# EAGLE schematic trig3_board_de0-nano (EAGLE 9.2.0)
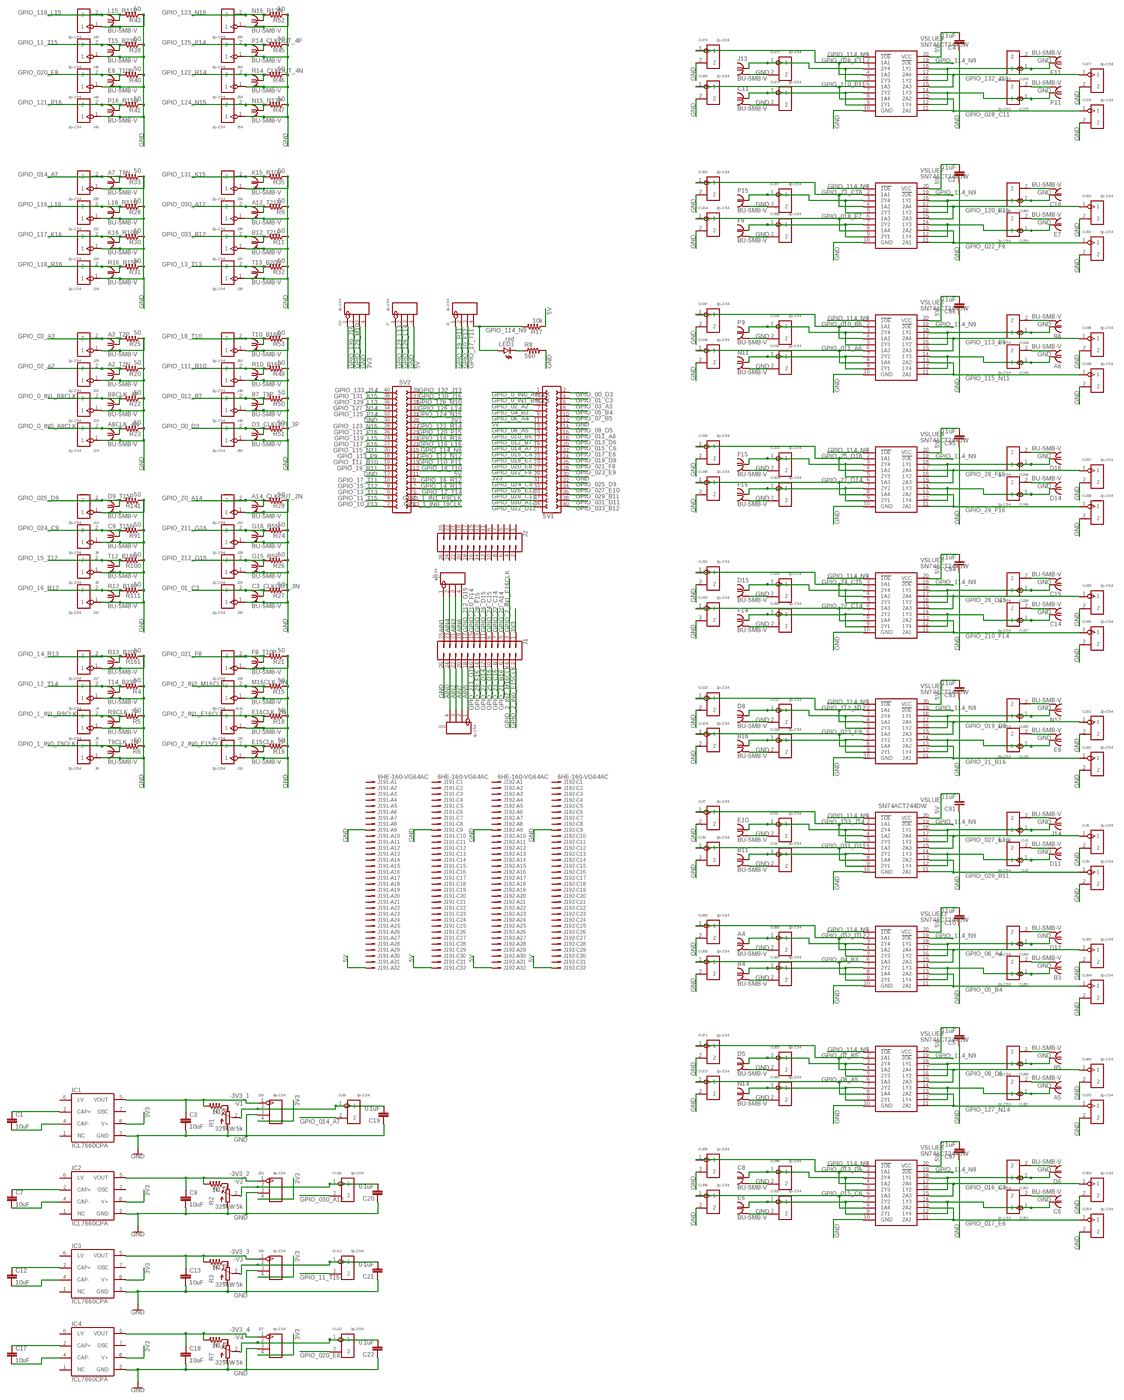
[diagram p0: schematic, sheet 1, overview]
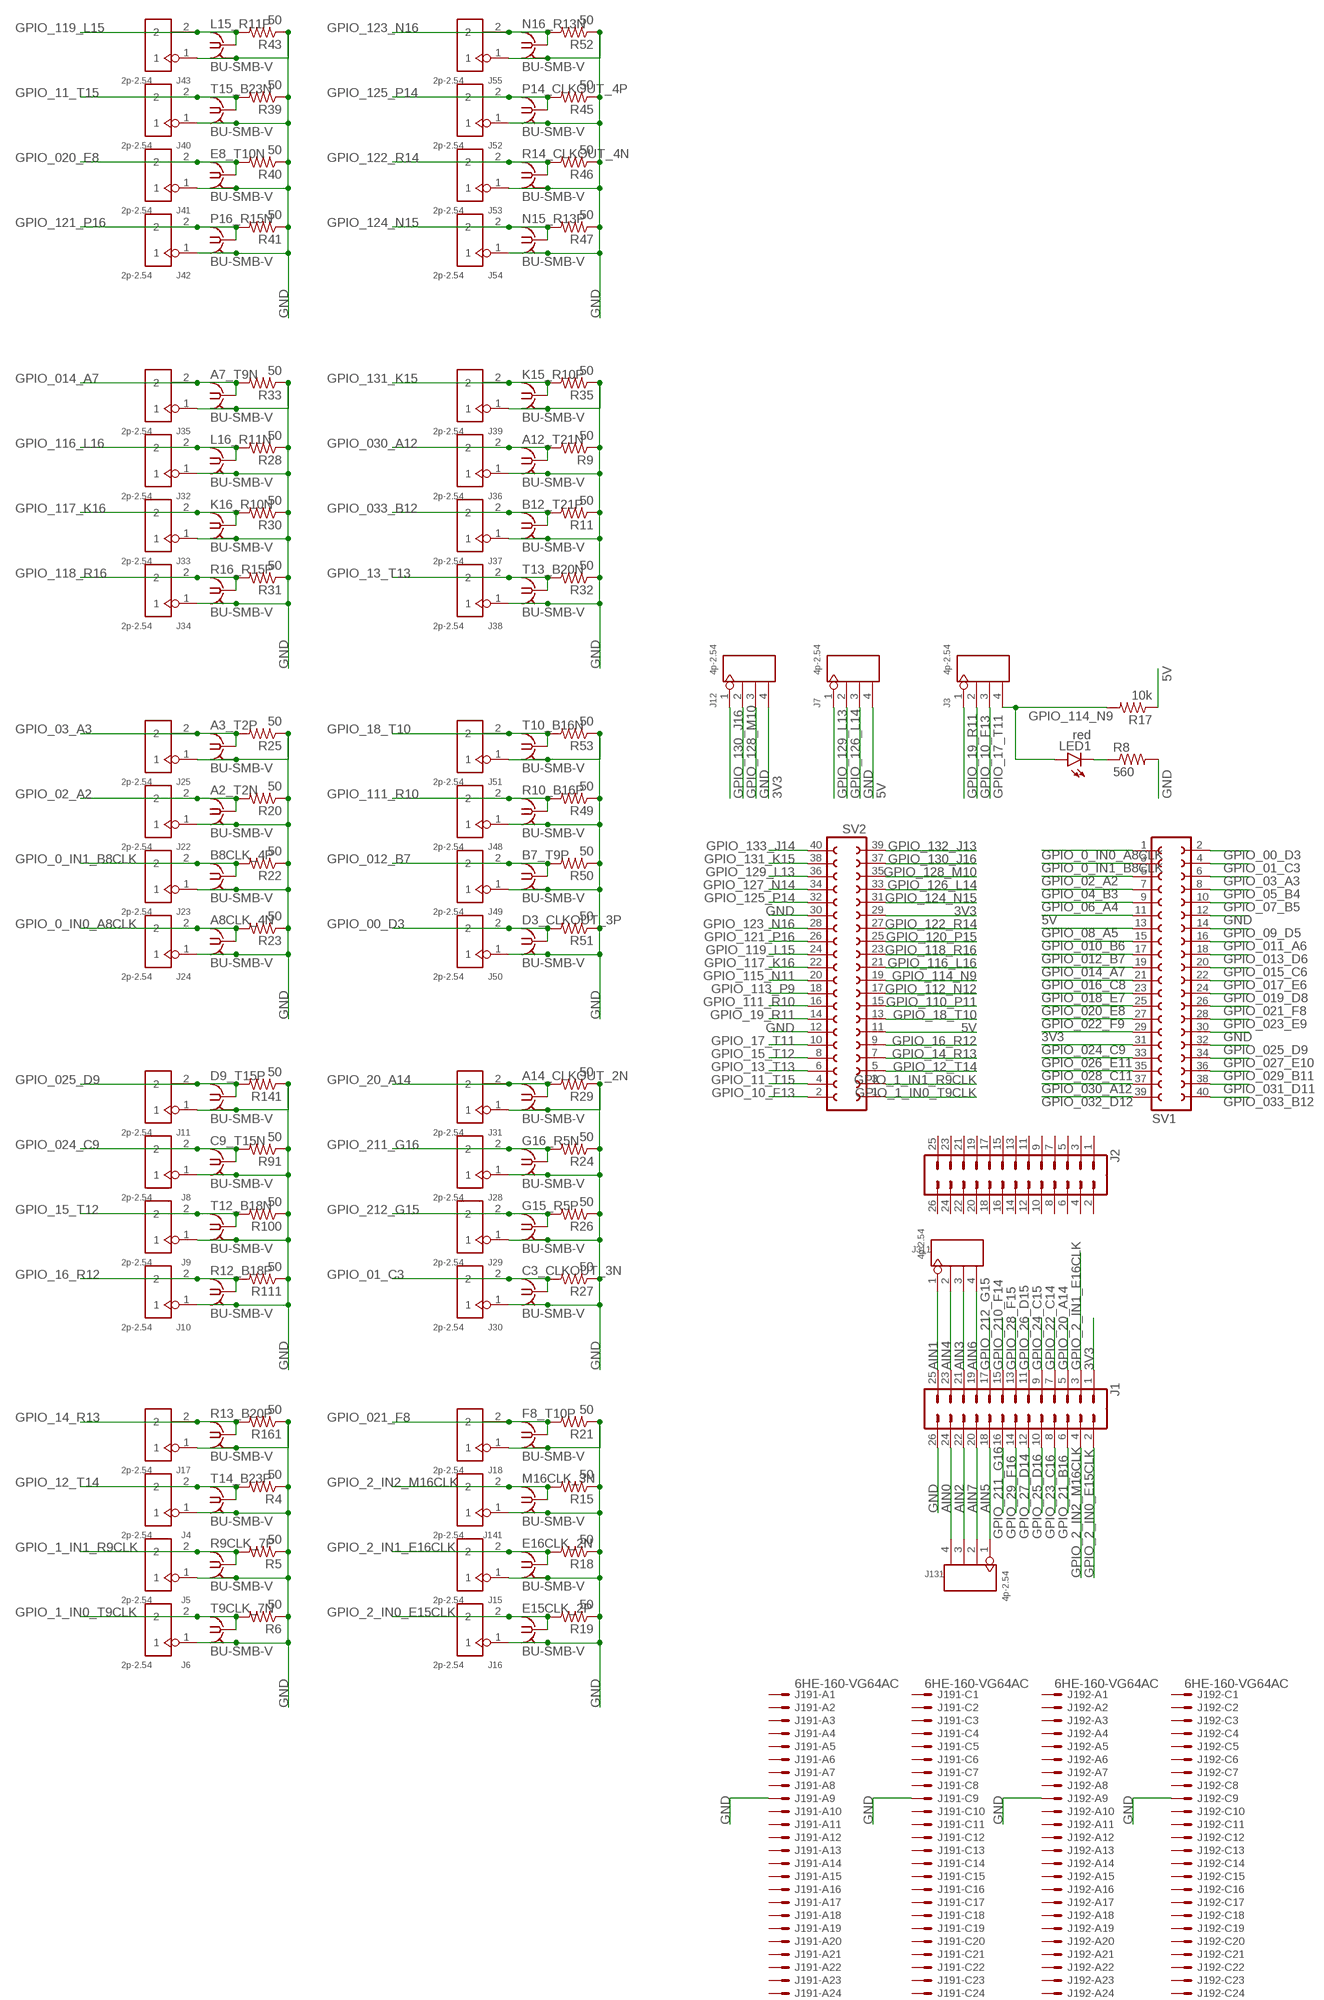
[diagram p1: schematic, sheet 1, part 1 of 4]
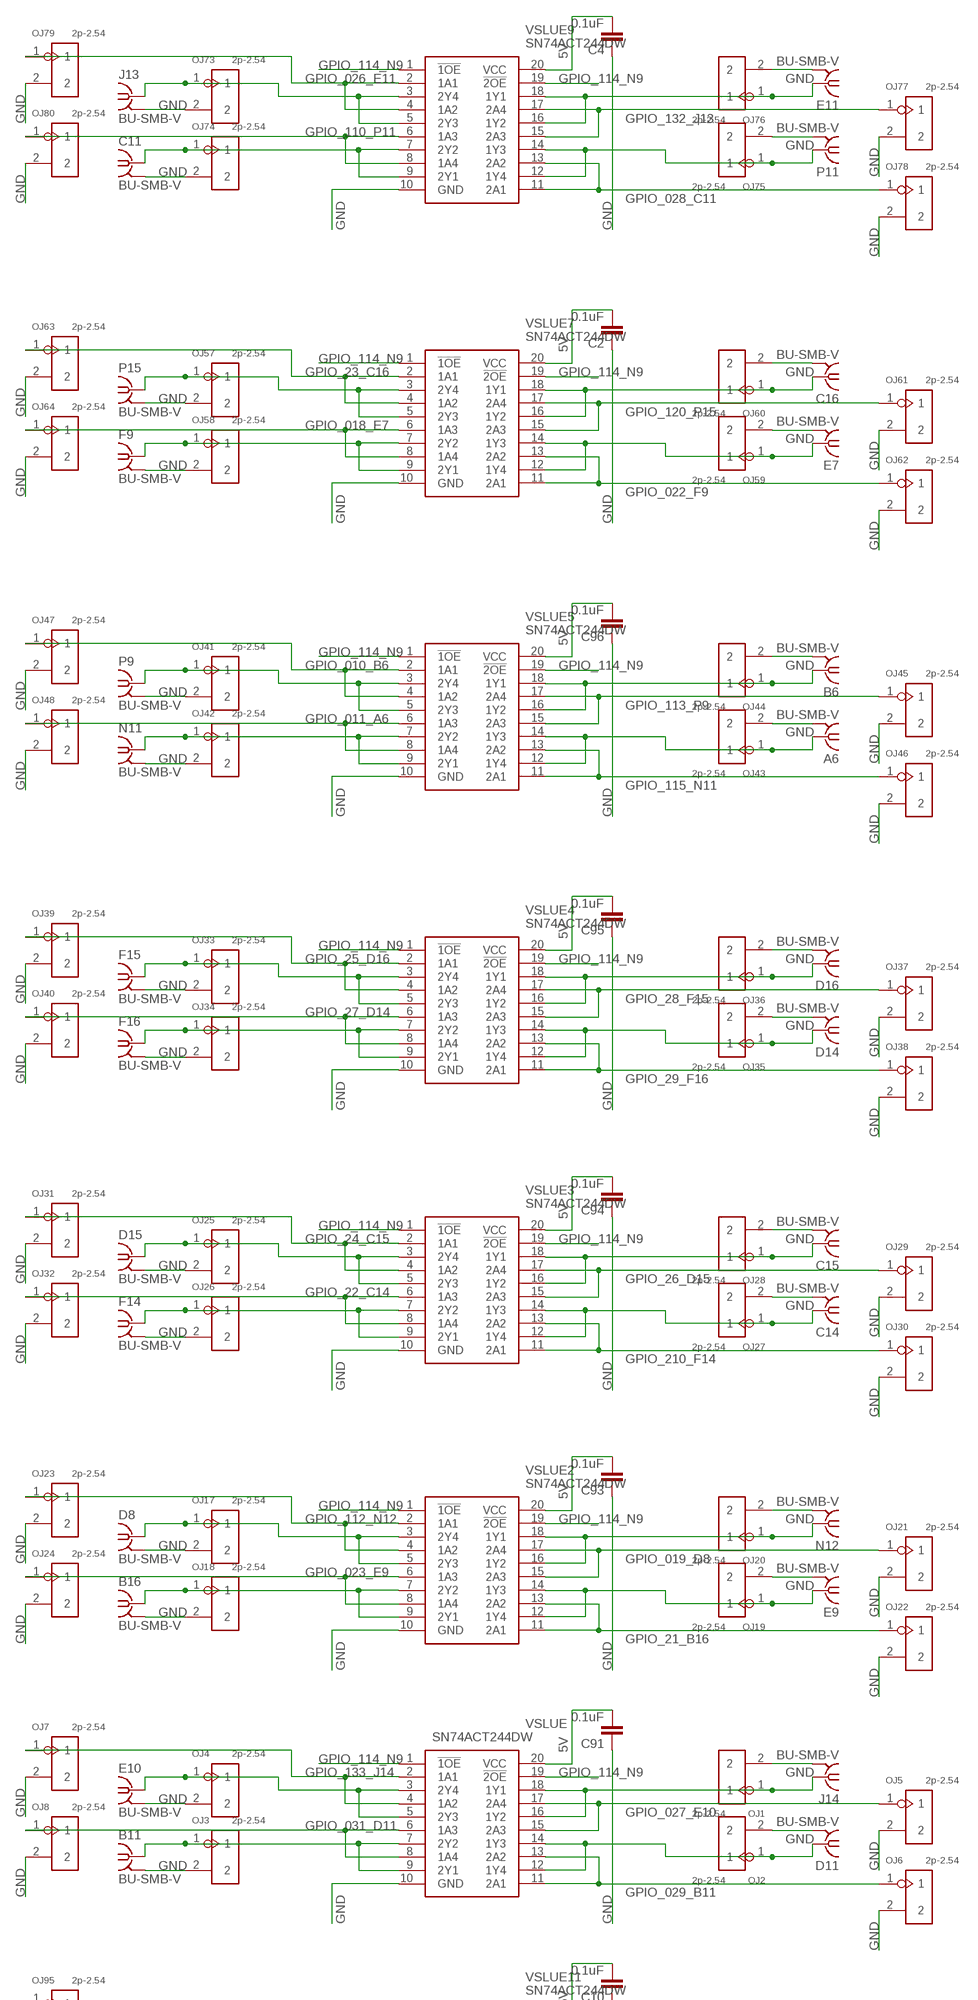
[diagram p2: schematic, sheet 1, part 2 of 4]
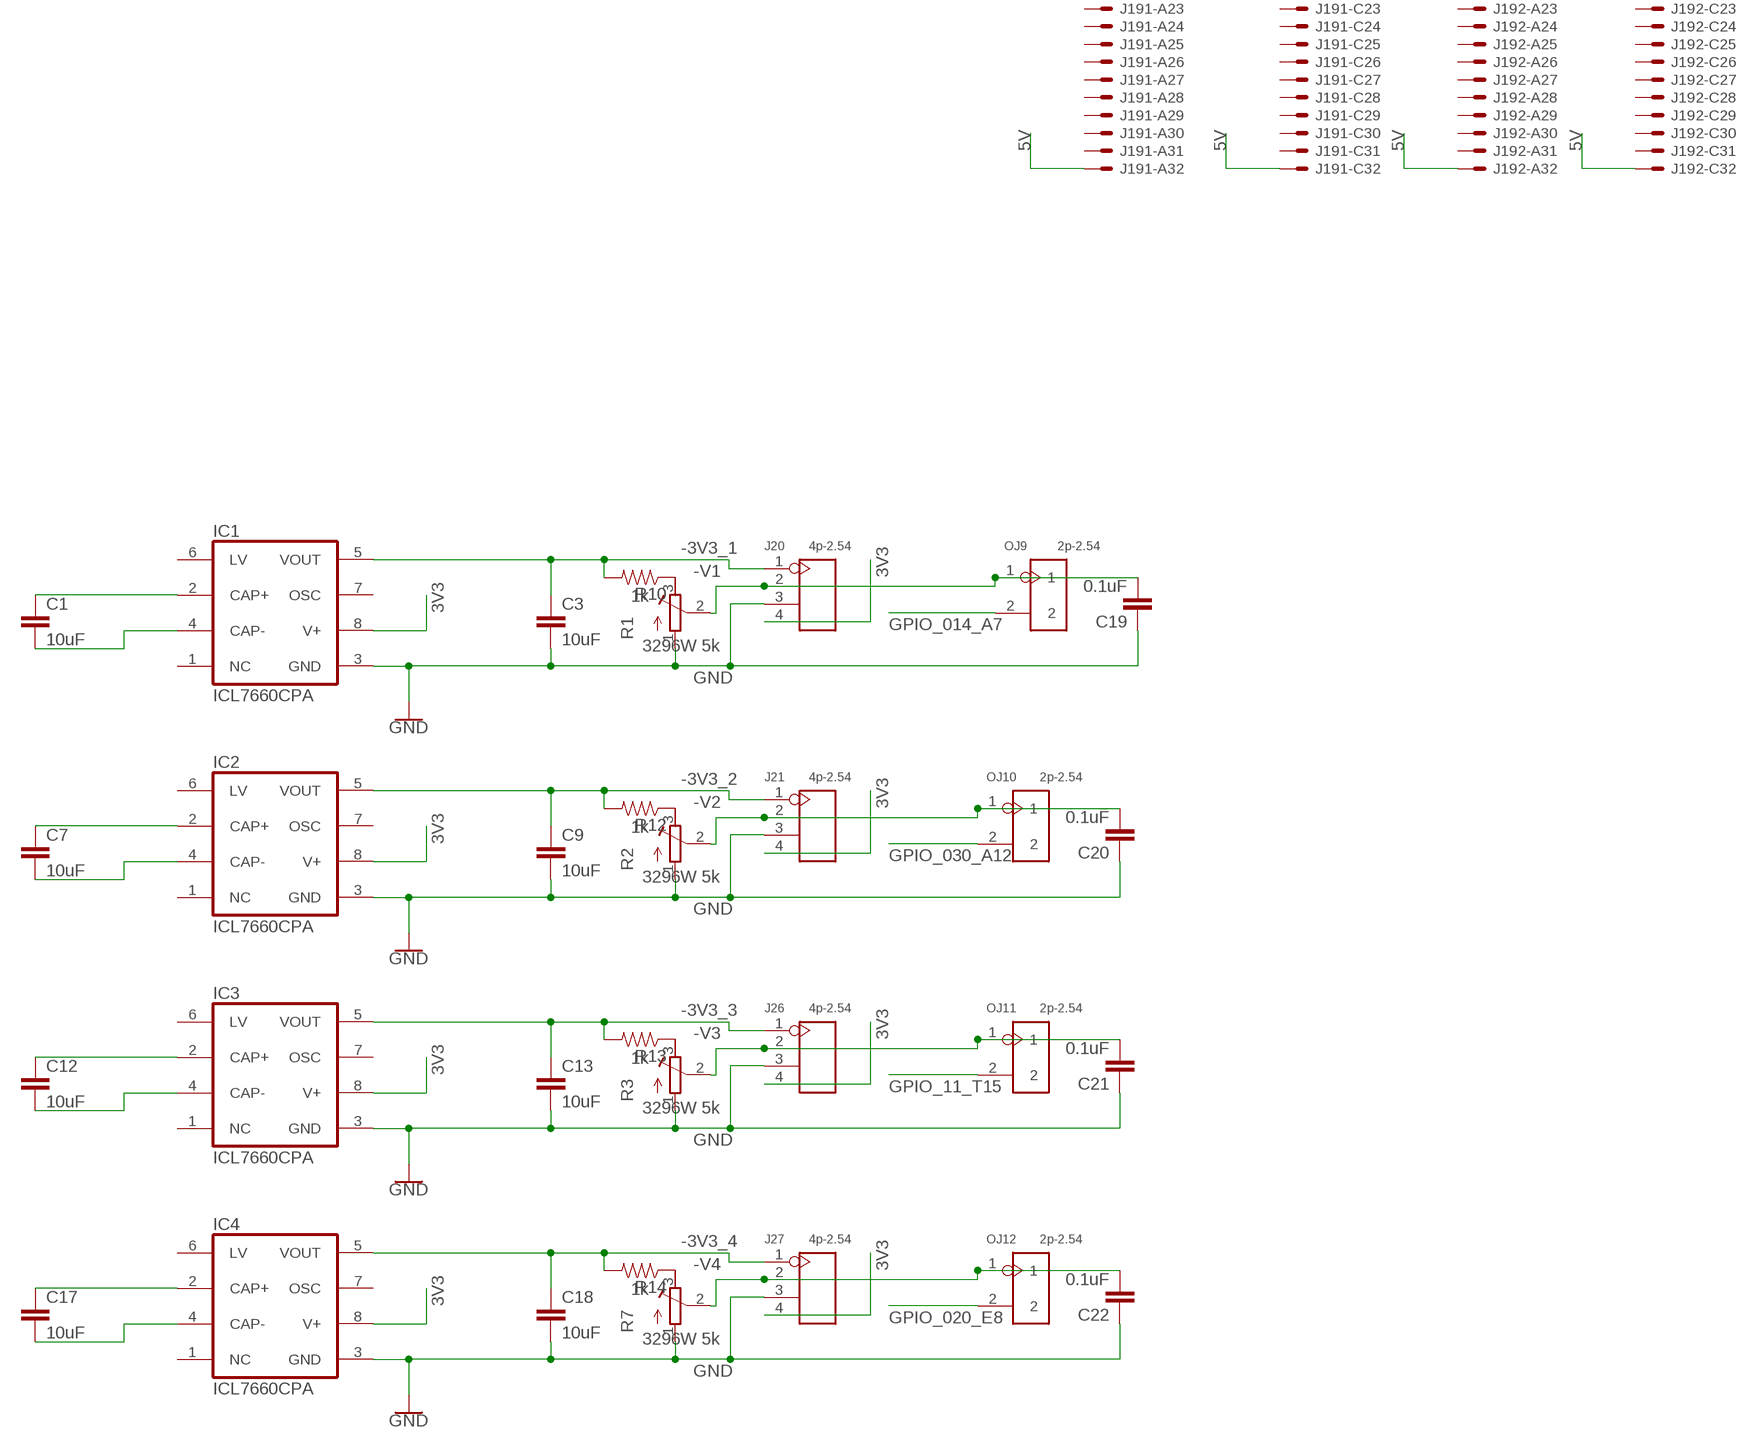
[diagram p3: schematic, sheet 1, part 3 of 4]
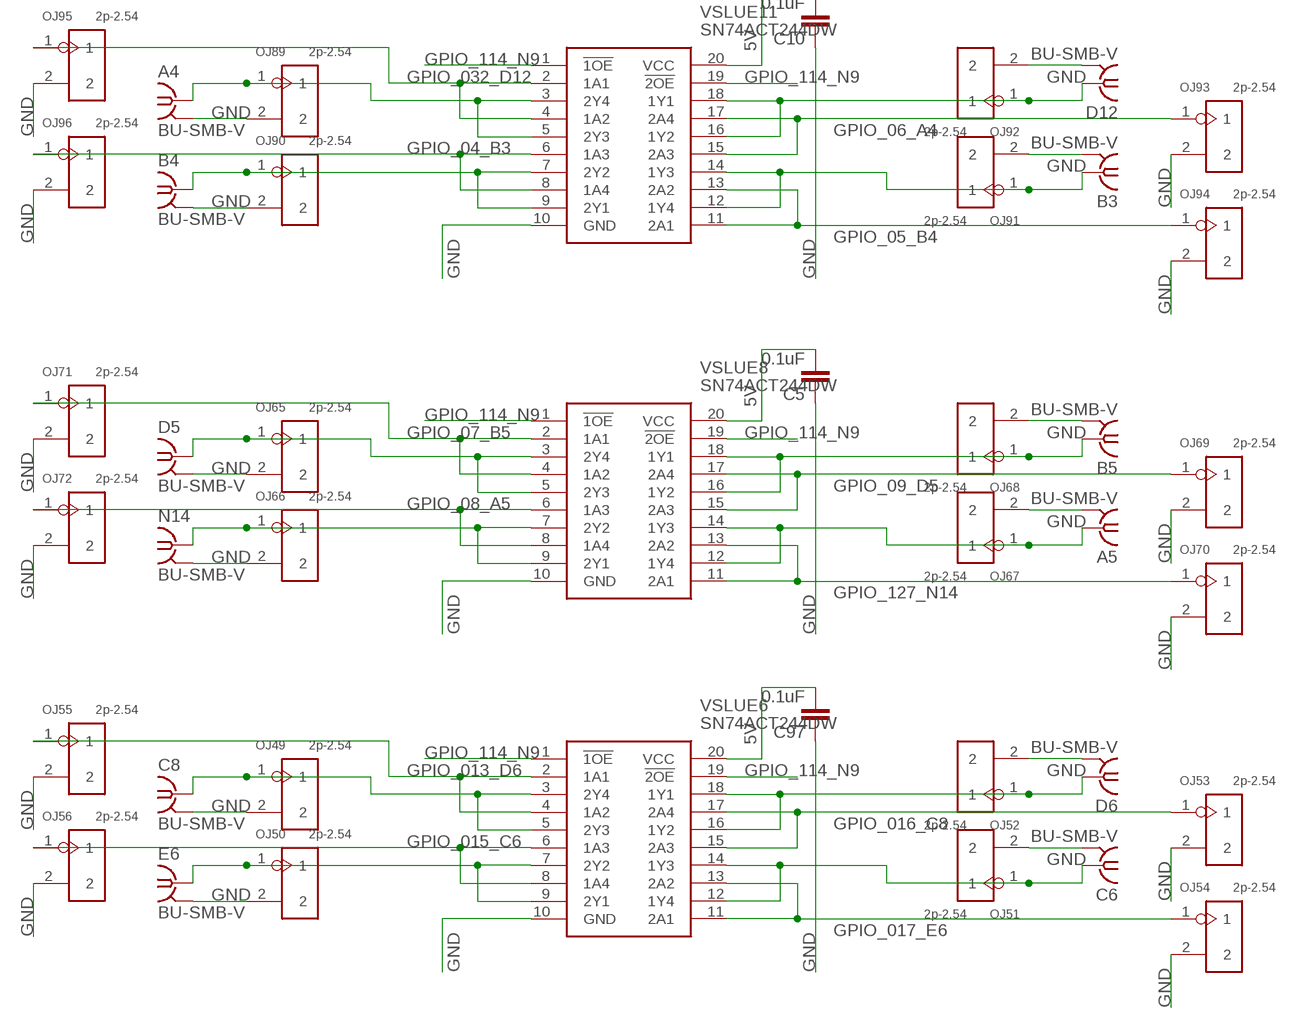
[diagram p4: schematic, sheet 1, part 4 of 4]

## Parts
A2_T2N  BU-SMB-V  [BU-SMB-V]
A3_T2P  BU-SMB-V  [BU-SMB-V]
A4  BU-SMB-V  [BU-SMB-V]
A5  BU-SMB-V  [BU-SMB-V]
A6  BU-SMB-V  [BU-SMB-V]
A7_T9N  BU-SMB-V  [BU-SMB-V]
A8CLK_4N  BU-SMB-V  [BU-SMB-V]
A12_T21N  BU-SMB-V  [BU-SMB-V]
A14_CLKOUT_2N  BU-SMB-V  [BU-SMB-V]
B3  BU-SMB-V  [BU-SMB-V]
B4  BU-SMB-V  [BU-SMB-V]
B5  BU-SMB-V  [BU-SMB-V]
B6  BU-SMB-V  [BU-SMB-V]
B7_T9P  BU-SMB-V  [BU-SMB-V]
B8CLK_4P  BU-SMB-V  [BU-SMB-V]
B11  BU-SMB-V  [BU-SMB-V]
B12_T21P  BU-SMB-V  [BU-SMB-V]
B16  BU-SMB-V  [BU-SMB-V]
C1  10uF  CAPPTH1  [CAP-PTH-5MM]
C2  0.1uF  CAP0805  [0805]
C3  10uF  CAPPTH1  [CAP-PTH-5MM]
C3_CLKOUT_3N  BU-SMB-V  [BU-SMB-V]
C4  0.1uF  CAP0805  [0805]
C5  0.1uF  CAP0805  [0805]
C6  BU-SMB-V  [BU-SMB-V]
C7  10uF  CAPPTH1  [CAP-PTH-5MM]
C8  BU-SMB-V  [BU-SMB-V]
C9  10uF  CAPPTH1  [CAP-PTH-5MM]
C9_T15N  BU-SMB-V  [BU-SMB-V]
C10  0.1uF  CAP0805  [0805]
C11  BU-SMB-V  [BU-SMB-V]
C12  10uF  CAPPTH1  [CAP-PTH-5MM]
C13  10uF  CAPPTH1  [CAP-PTH-5MM]
C14  BU-SMB-V  [BU-SMB-V]
C15  BU-SMB-V  [BU-SMB-V]
C16  BU-SMB-V  [BU-SMB-V]
C17  10uF  CAPPTH1  [CAP-PTH-5MM]
C18  10uF  CAPPTH1  [CAP-PTH-5MM]
C19  0.1uF  CAP0805  [0805]
C20  0.1uF  CAP0805  [0805]
C21  0.1uF  CAP0805  [0805]
C22  0.1uF  CAP0805  [0805]
C91  0.1uF  CAP0805  [0805]
C93  0.1uF  CAP0805  [0805]
C94  0.1uF  CAP0805  [0805]
C95  0.1uF  CAP0805  [0805]
C96  0.1uF  CAP0805  [0805]
C97  0.1uF  CAP0805  [0805]
D3_CLKOUT_3P  BU-SMB-V  [BU-SMB-V]
D5  BU-SMB-V  [BU-SMB-V]
D6  BU-SMB-V  [BU-SMB-V]
D8  BU-SMB-V  [BU-SMB-V]
D9_T15P  BU-SMB-V  [BU-SMB-V]
D11  BU-SMB-V  [BU-SMB-V]
D12  BU-SMB-V  [BU-SMB-V]
D14  BU-SMB-V  [BU-SMB-V]
D15  BU-SMB-V  [BU-SMB-V]
D16  BU-SMB-V  [BU-SMB-V]
E6  BU-SMB-V  [BU-SMB-V]
E7  BU-SMB-V  [BU-SMB-V]
E8_T10N  BU-SMB-V  [BU-SMB-V]
E9  BU-SMB-V  [BU-SMB-V]
E10  BU-SMB-V  [BU-SMB-V]
E11  BU-SMB-V  [BU-SMB-V]
E15CLK_2P  BU-SMB-V  [BU-SMB-V]
E16CLK_2N  BU-SMB-V  [BU-SMB-V]
F8_T10P  BU-SMB-V  [BU-SMB-V]
F9  BU-SMB-V  [BU-SMB-V]
F14  BU-SMB-V  [BU-SMB-V]
F15  BU-SMB-V  [BU-SMB-V]
F16  BU-SMB-V  [BU-SMB-V]
G15_R5P  BU-SMB-V  [BU-SMB-V]
G16_R5N  BU-SMB-V  [BU-SMB-V]
IC1  ICL7660CPA  [DIL08]
IC2  ICL7660CPA  [DIL08]
IC3  ICL7660CPA  [DIL08]
IC4  ICL7660CPA  [DIL08]
J1  M13X22X13  [2X13]
J2  M13X22X13  [2X13]
J3  4p-2.54  DIP-BLACK-FEMALE-HEADER-VERT(4P-2.54)  [H4-2.54]
J4  2p-2.54  DIP-BLACK-MALE-HEADER-VERT(2P-2.54)  [H2-2.54]
J5  2p-2.54  DIP-BLACK-MALE-HEADER-VERT(2P-2.54)  [H2-2.54]
J6  2p-2.54  DIP-BLACK-MALE-HEADER-VERT(2P-2.54)  [H2-2.54]
J7  4p-2.54  DIP-BLACK-FEMALE-HEADER-VERT(4P-2.54)  [H4-2.54]
J8  2p-2.54  DIP-BLACK-MALE-HEADER-VERT(2P-2.54)  [H2-2.54]
J9  2p-2.54  DIP-BLACK-MALE-HEADER-VERT(2P-2.54)  [H2-2.54]
J10  2p-2.54  DIP-BLACK-MALE-HEADER-VERT(2P-2.54)  [H2-2.54]
J11  2p-2.54  DIP-BLACK-MALE-HEADER-VERT(2P-2.54)  [H2-2.54]
J12  4p-2.54  DIP-BLACK-FEMALE-HEADER-VERT(4P-2.54)  [H4-2.54]
J13  BU-SMB-V  [BU-SMB-V]
J14  BU-SMB-V  [BU-SMB-V]
J15  2p-2.54  DIP-BLACK-MALE-HEADER-VERT(2P-2.54)  [H2-2.54]
J16  2p-2.54  DIP-BLACK-MALE-HEADER-VERT(2P-2.54)  [H2-2.54]
J17  2p-2.54  DIP-BLACK-MALE-HEADER-VERT(2P-2.54)  [H2-2.54]
J18  2p-2.54  DIP-BLACK-MALE-HEADER-VERT(2P-2.54)  [H2-2.54]
J19  6HE-160-VG64AC  [6HE_160-VG64AC]
J20  4p-2.54  DIP-BLACK-MALE-HEADER-VERT(4P-2.54)  [H4-2.54]
J21  4p-2.54  DIP-BLACK-MALE-HEADER-VERT(4P-2.54)  [H4-2.54]
J22  2p-2.54  DIP-BLACK-MALE-HEADER-VERT(2P-2.54)  [H2-2.54]
J23  2p-2.54  DIP-BLACK-MALE-HEADER-VERT(2P-2.54)  [H2-2.54]
J24  2p-2.54  DIP-BLACK-MALE-HEADER-VERT(2P-2.54)  [H2-2.54]
J25  2p-2.54  DIP-BLACK-MALE-HEADER-VERT(2P-2.54)  [H2-2.54]
J26  4p-2.54  DIP-BLACK-MALE-HEADER-VERT(4P-2.54)  [H4-2.54]
J27  4p-2.54  DIP-BLACK-MALE-HEADER-VERT(4P-2.54)  [H4-2.54]
J28  2p-2.54  DIP-BLACK-MALE-HEADER-VERT(2P-2.54)  [H2-2.54]
J29  2p-2.54  DIP-BLACK-MALE-HEADER-VERT(2P-2.54)  [H2-2.54]
J30  2p-2.54  DIP-BLACK-MALE-HEADER-VERT(2P-2.54)  [H2-2.54]
J31  2p-2.54  DIP-BLACK-MALE-HEADER-VERT(2P-2.54)  [H2-2.54]
J32  2p-2.54  DIP-BLACK-MALE-HEADER-VERT(2P-2.54)  [H2-2.54]
J33  2p-2.54  DIP-BLACK-MALE-HEADER-VERT(2P-2.54)  [H2-2.54]
J34  2p-2.54  DIP-BLACK-MALE-HEADER-VERT(2P-2.54)  [H2-2.54]
J35  2p-2.54  DIP-BLACK-MALE-HEADER-VERT(2P-2.54)  [H2-2.54]
J36  2p-2.54  DIP-BLACK-MALE-HEADER-VERT(2P-2.54)  [H2-2.54]
J37  2p-2.54  DIP-BLACK-MALE-HEADER-VERT(2P-2.54)  [H2-2.54]
J38  2p-2.54  DIP-BLACK-MALE-HEADER-VERT(2P-2.54)  [H2-2.54]
J39  2p-2.54  DIP-BLACK-MALE-HEADER-VERT(2P-2.54)  [H2-2.54]
J40  2p-2.54  DIP-BLACK-MALE-HEADER-VERT(2P-2.54)  [H2-2.54]
J41  2p-2.54  DIP-BLACK-MALE-HEADER-VERT(2P-2.54)  [H2-2.54]
J42  2p-2.54  DIP-BLACK-MALE-HEADER-VERT(2P-2.54)  [H2-2.54]
J43  2p-2.54  DIP-BLACK-MALE-HEADER-VERT(2P-2.54)  [H2-2.54]
J48  2p-2.54  DIP-BLACK-MALE-HEADER-VERT(2P-2.54)  [H2-2.54]
J49  2p-2.54  DIP-BLACK-MALE-HEADER-VERT(2P-2.54)  [H2-2.54]
J50  2p-2.54  DIP-BLACK-MALE-HEADER-VERT(2P-2.54)  [H2-2.54]
J51  2p-2.54  DIP-BLACK-MALE-HEADER-VERT(2P-2.54)  [H2-2.54]
J52  2p-2.54  DIP-BLACK-MALE-HEADER-VERT(2P-2.54)  [H2-2.54]
J53  2p-2.54  DIP-BLACK-MALE-HEADER-VERT(2P-2.54)  [H2-2.54]
J54  2p-2.54  DIP-BLACK-MALE-HEADER-VERT(2P-2.54)  [H2-2.54]
J55  2p-2.54  DIP-BLACK-MALE-HEADER-VERT(2P-2.54)  [H2-2.54]
J131  4p-2.54  DIP-BLACK-FEMALE-HEADER-VERT(4P-2.54)  [H4-2.54]
J141  2p-2.54  DIP-BLACK-MALE-HEADER-VERT(2P-2.54)  [H2-2.54]
J311  4p-2.54  DIP-BLACK-FEMALE-HEADER-VERT(4P-2.54)  [H4-2.54]
K15_R10P  BU-SMB-V  [BU-SMB-V]
K16_R10N  BU-SMB-V  [BU-SMB-V]
L15_R11P  BU-SMB-V  [BU-SMB-V]
L16_R11N  BU-SMB-V  [BU-SMB-V]
LED1  red  LEDCHIP-LED0805  [CHIP-LED0805]
M16CLK_3N  BU-SMB-V  [BU-SMB-V]
N11  BU-SMB-V  [BU-SMB-V]
N12  BU-SMB-V  [BU-SMB-V]
N14  BU-SMB-V  [BU-SMB-V]
N15_R13P  BU-SMB-V  [BU-SMB-V]
N16_R13N  BU-SMB-V  [BU-SMB-V]
OJ1  2p-2.54  DIP-BLACK-MALE-HEADER-VERT(2P-2.54)  [H2-2.54]
OJ2  2p-2.54  DIP-BLACK-MALE-HEADER-VERT(2P-2.54)  [H2-2.54]
OJ3  2p-2.54  DIP-BLACK-MALE-HEADER-VERT(2P-2.54)  [H2-2.54]
OJ4  2p-2.54  DIP-BLACK-MALE-HEADER-VERT(2P-2.54)  [H2-2.54]
OJ5  2p-2.54  DIP-BLACK-MALE-HEADER-VERT(2P-2.54)  [H2-2.54]
OJ6  2p-2.54  DIP-BLACK-MALE-HEADER-VERT(2P-2.54)  [H2-2.54]
OJ7  2p-2.54  DIP-BLACK-MALE-HEADER-VERT(2P-2.54)  [H2-2.54]
OJ8  2p-2.54  DIP-BLACK-MALE-HEADER-VERT(2P-2.54)  [H2-2.54]
OJ9  2p-2.54  DIP-BLACK-MALE-HEADER-VERT(2P-2.54)  [H2-2.54]
OJ10  2p-2.54  DIP-BLACK-MALE-HEADER-VERT(2P-2.54)  [H2-2.54]
OJ11  2p-2.54  DIP-BLACK-MALE-HEADER-VERT(2P-2.54)  [H2-2.54]
OJ12  2p-2.54  DIP-BLACK-MALE-HEADER-VERT(2P-2.54)  [H2-2.54]
OJ17  2p-2.54  DIP-BLACK-MALE-HEADER-VERT(2P-2.54)  [H2-2.54]
OJ18  2p-2.54  DIP-BLACK-MALE-HEADER-VERT(2P-2.54)  [H2-2.54]
OJ19  2p-2.54  DIP-BLACK-MALE-HEADER-VERT(2P-2.54)  [H2-2.54]
OJ20  2p-2.54  DIP-BLACK-MALE-HEADER-VERT(2P-2.54)  [H2-2.54]
OJ21  2p-2.54  DIP-BLACK-MALE-HEADER-VERT(2P-2.54)  [H2-2.54]
OJ22  2p-2.54  DIP-BLACK-MALE-HEADER-VERT(2P-2.54)  [H2-2.54]
OJ23  2p-2.54  DIP-BLACK-MALE-HEADER-VERT(2P-2.54)  [H2-2.54]
OJ24  2p-2.54  DIP-BLACK-MALE-HEADER-VERT(2P-2.54)  [H2-2.54]
OJ25  2p-2.54  DIP-BLACK-MALE-HEADER-VERT(2P-2.54)  [H2-2.54]
OJ26  2p-2.54  DIP-BLACK-MALE-HEADER-VERT(2P-2.54)  [H2-2.54]
OJ27  2p-2.54  DIP-BLACK-MALE-HEADER-VERT(2P-2.54)  [H2-2.54]
OJ28  2p-2.54  DIP-BLACK-MALE-HEADER-VERT(2P-2.54)  [H2-2.54]
OJ29  2p-2.54  DIP-BLACK-MALE-HEADER-VERT(2P-2.54)  [H2-2.54]
OJ30  2p-2.54  DIP-BLACK-MALE-HEADER-VERT(2P-2.54)  [H2-2.54]
OJ31  2p-2.54  DIP-BLACK-MALE-HEADER-VERT(2P-2.54)  [H2-2.54]
OJ32  2p-2.54  DIP-BLACK-MALE-HEADER-VERT(2P-2.54)  [H2-2.54]
OJ33  2p-2.54  DIP-BLACK-MALE-HEADER-VERT(2P-2.54)  [H2-2.54]
OJ34  2p-2.54  DIP-BLACK-MALE-HEADER-VERT(2P-2.54)  [H2-2.54]
OJ35  2p-2.54  DIP-BLACK-MALE-HEADER-VERT(2P-2.54)  [H2-2.54]
OJ36  2p-2.54  DIP-BLACK-MALE-HEADER-VERT(2P-2.54)  [H2-2.54]
OJ37  2p-2.54  DIP-BLACK-MALE-HEADER-VERT(2P-2.54)  [H2-2.54]
OJ38  2p-2.54  DIP-BLACK-MALE-HEADER-VERT(2P-2.54)  [H2-2.54]
OJ39  2p-2.54  DIP-BLACK-MALE-HEADER-VERT(2P-2.54)  [H2-2.54]
OJ40  2p-2.54  DIP-BLACK-MALE-HEADER-VERT(2P-2.54)  [H2-2.54]
OJ41  2p-2.54  DIP-BLACK-MALE-HEADER-VERT(2P-2.54)  [H2-2.54]
OJ42  2p-2.54  DIP-BLACK-MALE-HEADER-VERT(2P-2.54)  [H2-2.54]
OJ43  2p-2.54  DIP-BLACK-MALE-HEADER-VERT(2P-2.54)  [H2-2.54]
OJ44  2p-2.54  DIP-BLACK-MALE-HEADER-VERT(2P-2.54)  [H2-2.54]
OJ45  2p-2.54  DIP-BLACK-MALE-HEADER-VERT(2P-2.54)  [H2-2.54]
OJ46  2p-2.54  DIP-BLACK-MALE-HEADER-VERT(2P-2.54)  [H2-2.54]
OJ47  2p-2.54  DIP-BLACK-MALE-HEADER-VERT(2P-2.54)  [H2-2.54]
OJ48  2p-2.54  DIP-BLACK-MALE-HEADER-VERT(2P-2.54)  [H2-2.54]
OJ49  2p-2.54  DIP-BLACK-MALE-HEADER-VERT(2P-2.54)  [H2-2.54]
OJ50  2p-2.54  DIP-BLACK-MALE-HEADER-VERT(2P-2.54)  [H2-2.54]
OJ51  2p-2.54  DIP-BLACK-MALE-HEADER-VERT(2P-2.54)  [H2-2.54]
OJ52  2p-2.54  DIP-BLACK-MALE-HEADER-VERT(2P-2.54)  [H2-2.54]
OJ53  2p-2.54  DIP-BLACK-MALE-HEADER-VERT(2P-2.54)  [H2-2.54]
OJ54  2p-2.54  DIP-BLACK-MALE-HEADER-VERT(2P-2.54)  [H2-2.54]
OJ55  2p-2.54  DIP-BLACK-MALE-HEADER-VERT(2P-2.54)  [H2-2.54]
OJ56  2p-2.54  DIP-BLACK-MALE-HEADER-VERT(2P-2.54)  [H2-2.54]
OJ57  2p-2.54  DIP-BLACK-MALE-HEADER-VERT(2P-2.54)  [H2-2.54]
OJ58  2p-2.54  DIP-BLACK-MALE-HEADER-VERT(2P-2.54)  [H2-2.54]
OJ59  2p-2.54  DIP-BLACK-MALE-HEADER-VERT(2P-2.54)  [H2-2.54]
OJ60  2p-2.54  DIP-BLACK-MALE-HEADER-VERT(2P-2.54)  [H2-2.54]
OJ61  2p-2.54  DIP-BLACK-MALE-HEADER-VERT(2P-2.54)  [H2-2.54]
OJ62  2p-2.54  DIP-BLACK-MALE-HEADER-VERT(2P-2.54)  [H2-2.54]
OJ63  2p-2.54  DIP-BLACK-MALE-HEADER-VERT(2P-2.54)  [H2-2.54]
OJ64  2p-2.54  DIP-BLACK-MALE-HEADER-VERT(2P-2.54)  [H2-2.54]
OJ65  2p-2.54  DIP-BLACK-MALE-HEADER-VERT(2P-2.54)  [H2-2.54]
OJ66  2p-2.54  DIP-BLACK-MALE-HEADER-VERT(2P-2.54)  [H2-2.54]
OJ67  2p-2.54  DIP-BLACK-MALE-HEADER-VERT(2P-2.54)  [H2-2.54]
OJ68  2p-2.54  DIP-BLACK-MALE-HEADER-VERT(2P-2.54)  [H2-2.54]
OJ69  2p-2.54  DIP-BLACK-MALE-HEADER-VERT(2P-2.54)  [H2-2.54]
OJ70  2p-2.54  DIP-BLACK-MALE-HEADER-VERT(2P-2.54)  [H2-2.54]
OJ71  2p-2.54  DIP-BLACK-MALE-HEADER-VERT(2P-2.54)  [H2-2.54]
OJ72  2p-2.54  DIP-BLACK-MALE-HEADER-VERT(2P-2.54)  [H2-2.54]
OJ73  2p-2.54  DIP-BLACK-MALE-HEADER-VERT(2P-2.54)  [H2-2.54]
OJ74  2p-2.54  DIP-BLACK-MALE-HEADER-VERT(2P-2.54)  [H2-2.54]
OJ75  2p-2.54  DIP-BLACK-MALE-HEADER-VERT(2P-2.54)  [H2-2.54]
OJ76  2p-2.54  DIP-BLACK-MALE-HEADER-VERT(2P-2.54)  [H2-2.54]
OJ77  2p-2.54  DIP-BLACK-MALE-HEADER-VERT(2P-2.54)  [H2-2.54]
OJ78  2p-2.54  DIP-BLACK-MALE-HEADER-VERT(2P-2.54)  [H2-2.54]
OJ79  2p-2.54  DIP-BLACK-MALE-HEADER-VERT(2P-2.54)  [H2-2.54]
OJ80  2p-2.54  DIP-BLACK-MALE-HEADER-VERT(2P-2.54)  [H2-2.54]
OJ89  2p-2.54  DIP-BLACK-MALE-HEADER-VERT(2P-2.54)  [H2-2.54]
OJ90  2p-2.54  DIP-BLACK-MALE-HEADER-VERT(2P-2.54)  [H2-2.54]
OJ91  2p-2.54  DIP-BLACK-MALE-HEADER-VERT(2P-2.54)  [H2-2.54]
OJ92  2p-2.54  DIP-BLACK-MALE-HEADER-VERT(2P-2.54)  [H2-2.54]
OJ93  2p-2.54  DIP-BLACK-MALE-HEADER-VERT(2P-2.54)  [H2-2.54]
OJ94  2p-2.54  DIP-BLACK-MALE-HEADER-VERT(2P-2.54)  [H2-2.54]
OJ95  2p-2.54  DIP-BLACK-MALE-HEADER-VERT(2P-2.54)  [H2-2.54]
OJ96  2p-2.54  DIP-BLACK-MALE-HEADER-VERT(2P-2.54)  [H2-2.54]
P9  BU-SMB-V  [BU-SMB-V]
P11  BU-SMB-V  [BU-SMB-V]
P14_CLKOUT_4P  BU-SMB-V  [BU-SMB-V]
P15  BU-SMB-V  [BU-SMB-V]
P16_R15N  BU-SMB-V  [BU-SMB-V]
R1  3296W 5k  R-TRIMM3296W  [RTRIM3296W]
R2  3296W 5k  R-TRIMM3296W  [RTRIM3296W]
R3  3296W 5k  R-TRIMM3296W  [RTRIM3296W]
R4  50  RESISTORAXIAL-0.3  [AXIAL-0.3]
R5  50  RESISTORAXIAL-0.3  [AXIAL-0.3]
R6  50  RESISTORAXIAL-0.3  [AXIAL-0.3]
R7  3296W 5k  R-TRIMM3296W  [RTRIM3296W]
R8  560  R-US_R0805  [R0805]
R9  50  RESISTORAXIAL-0.3  [AXIAL-0.3]
R9CLK_7P  BU-SMB-V  [BU-SMB-V]
R10  1k  RESISTORAXIAL-0.3  [AXIAL-0.3]
R10_B16P  BU-SMB-V  [BU-SMB-V]
R11  50  RESISTORAXIAL-0.3  [AXIAL-0.3]
R12  1k  RESISTORAXIAL-0.3  [AXIAL-0.3]
R12_B18P  BU-SMB-V  [BU-SMB-V]
R13  1k  RESISTORAXIAL-0.3  [AXIAL-0.3]
R13_B20P  BU-SMB-V  [BU-SMB-V]
R14  1k  RESISTORAXIAL-0.3  [AXIAL-0.3]
R14_CLKOUT_4N  BU-SMB-V  [BU-SMB-V]
R15  50  RESISTORAXIAL-0.3  [AXIAL-0.3]
R16_R15P  BU-SMB-V  [BU-SMB-V]
R17  10k  RESISTORAXIAL-0.3  [AXIAL-0.3]
R18  50  RESISTORAXIAL-0.3  [AXIAL-0.3]
R19  50  RESISTORAXIAL-0.3  [AXIAL-0.3]
R20  50  RESISTORAXIAL-0.3  [AXIAL-0.3]
R21  50  RESISTORAXIAL-0.3  [AXIAL-0.3]
R22  50  RESISTORAXIAL-0.3  [AXIAL-0.3]
R23  50  RESISTORAXIAL-0.3  [AXIAL-0.3]
R24  50  RESISTORAXIAL-0.3  [AXIAL-0.3]
R25  50  RESISTORAXIAL-0.3  [AXIAL-0.3]
R26  50  RESISTORAXIAL-0.3  [AXIAL-0.3]
R27  50  RESISTORAXIAL-0.3  [AXIAL-0.3]
R28  50  RESISTORAXIAL-0.3  [AXIAL-0.3]
R29  50  RESISTORAXIAL-0.3  [AXIAL-0.3]
R30  50  RESISTORAXIAL-0.3  [AXIAL-0.3]
R31  50  RESISTORAXIAL-0.3  [AXIAL-0.3]
R32  50  RESISTORAXIAL-0.3  [AXIAL-0.3]
R33  50  RESISTORAXIAL-0.3  [AXIAL-0.3]
R35  50  RESISTORAXIAL-0.3  [AXIAL-0.3]
R39  50  RESISTORAXIAL-0.3  [AXIAL-0.3]
R40  50  RESISTORAXIAL-0.3  [AXIAL-0.3]
R41  50  RESISTORAXIAL-0.3  [AXIAL-0.3]
R43  50  RESISTORAXIAL-0.3  [AXIAL-0.3]
R45  50  RESISTORAXIAL-0.3  [AXIAL-0.3]
R46  50  RESISTORAXIAL-0.3  [AXIAL-0.3]
R47  50  RESISTORAXIAL-0.3  [AXIAL-0.3]
R49  50  RESISTORAXIAL-0.3  [AXIAL-0.3]
R50  50  RESISTORAXIAL-0.3  [AXIAL-0.3]
R51  50  RESISTORAXIAL-0.3  [AXIAL-0.3]
R52  50  RESISTORAXIAL-0.3  [AXIAL-0.3]
R53  50  RESISTORAXIAL-0.3  [AXIAL-0.3]
R91  50  RESISTORAXIAL-0.3  [AXIAL-0.3]
R100  50  RESISTORAXIAL-0.3  [AXIAL-0.3]
R111  50  RESISTORAXIAL-0.3  [AXIAL-0.3]
R141  50  RESISTORAXIAL-0.3  [AXIAL-0.3]
R161  50  RESISTORAXIAL-0.3  [AXIAL-0.3]
SV1  FE20-2  [FE20-2]
SV2  FE20-2  [FE20-2]
T9CLK_7N  BU-SMB-V  [BU-SMB-V]
T10_B16N  BU-SMB-V  [BU-SMB-V]
T12_B18N  BU-SMB-V  [BU-SMB-V]
T13_B20N  BU-SMB-V  [BU-SMB-V]
T14_B23P  BU-SMB-V  [BU-SMB-V]
T15_B23N  BU-SMB-V  [BU-SMB-V]
VSLUE  SN74ACT244DW  [SOIC127P1030X265-20N]
VSLUE2  SN74ACT244DW  [SOIC127P1030X265-20N]
VSLUE3  SN74ACT244DW  [SOIC127P1030X265-20N]
VSLUE4  SN74ACT244DW  [SOIC127P1030X265-20N]
VSLUE5  SN74ACT244DW  [SOIC127P1030X265-20N]
VSLUE6  SN74ACT244DW  [SOIC127P1030X265-20N]
VSLUE7  SN74ACT244DW  [SOIC127P1030X265-20N]
VSLUE8  SN74ACT244DW  [SOIC127P1030X265-20N]
VSLUE9  SN74ACT244DW  [SOIC127P1030X265-20N]
VSLUE11  SN74ACT244DW  [SOIC127P1030X265-20N]

## Nets
3V3 [power]: IC1.8(V+) IC2.8(V+) IC3.8(V+) IC4.8(V+) J1.1 J12.4 J20.4 J21.4 J26.4 J27.4 SV1.29 SV2.29
5V [power]: C2.2 C4.2 C5.2 C10.2 C91.2 C93.2 C94.2 C95.2 C96.2 C97.2 J7.4 J19.1-A32 J19.1-C32 J19.2-A32 J19.2-C32 R17.P$1 SV1.11 SV2.11 VSLUE2.20(VCC) VSLUE3.20(VCC) VSLUE4.20(VCC) VSLUE5.20(VCC) VSLUE6.20(VCC) VSLUE7.20(VCC) VSLUE8.20(VCC) VSLUE9.20(VCC) VSLUE11.20(VCC) VSLUE.20(VCC)
-3V3_1: C3.1 IC1.5(VOUT) J20.1 R10.P$2
-3V3_2: C9.1 IC2.5(VOUT) J21.1 R12.P$2
-3V3_3: C13.1 IC3.5(VOUT) J26.1 R13.P$2
-3V3_4: C18.1 IC4.5(VOUT) J27.1 R14.P$2
-V1: C19.2 J20.2 OJ9.1 R1.2(S)
-V2: C20.2 J21.2 OJ10.1 R2.2(S)
-V3: C21.2 J26.2 OJ11.1 R3.2(S)
-V4: C22.2 J27.2 OJ12.1 R7.2(S)
AIN0: J1.24 J131.4
AIN1: J1.25 J311.1
AIN2: J1.22 J131.3
AIN3: J1.21 J311.3
AIN4: J1.23 J311.2
AIN5: J1.18 J131.1
AIN6: J1.19 J311.4
AIN7: J1.20 J131.2
GND: A2_T2N.2 A2_T2N.3 A2_T2N.4 A2_T2N.5 A3_T2P.2 A3_T2P.3 A3_T2P.4 A3_T2P.5 A4.2 A4.3 A4.4 A4.5 A5.2 A5.3 A5.4 A5.5 A6.2 A6.3 A6.4 A6.5 A7_T9N.2 A7_T9N.3 A7_T9N.4 A7_T9N.5 A8CLK_4N.2 A8CLK_4N.3 A8CLK_4N.4 A8CLK_4N.5 A12_T21N.2 A12_T21N.3 A12_T21N.4 A12_T21N.5 A14_CLKOUT_2N.2 A14_CLKOUT_2N.3 A14_CLKOUT_2N.4 A14_CLKOUT_2N.5 B3.2 B3.3 B3.4 B3.5 B4.2 B4.3 B4.4 B4.5 B5.2 B5.3 B5.4 B5.5 B6.2 B6.3 B6.4 B6.5 B7_T9P.2 B7_T9P.3 B7_T9P.4 B7_T9P.5 B8CLK_4P.2 B8CLK_4P.3 B8CLK_4P.4 B8CLK_4P.5 B11.2 B11.3 B11.4 B11.5 B12_T21P.2 B12_T21P.3 B12_T21P.4 B12_T21P.5 B16.2 B16.3 B16.4 B16.5 C2.1 C3.2 C3_CLKOUT_3N.2 C3_CLKOUT_3N.3 C3_CLKOUT_3N.4 C3_CLKOUT_3N.5 C4.1 C5.1 C6.2 C6.3 C6.4 C6.5 C8.2 C8.3 C8.4 C8.5 C9.2 C9_T15N.2 C9_T15N.3 C9_T15N.4 C9_T15N.5 C10.1 C11.2 C11.3 C11.4 C11.5 C13.2 C14.2 C14.3 C14.4 C14.5 C15.2 C15.3 C15.4 C15.5 C16.2 C16.3 C16.4 C16.5 C18.2 C19.1 C20.1 C21.1 C22.1 C91.1 C93.1 C94.1 C95.1 C96.1 C97.1 D3_CLKOUT_3P.2 D3_CLKOUT_3P.3 D3_CLKOUT_3P.4 D3_CLKOUT_3P.5 D5.2 D5.3 D5.4 D5.5 D6.2 D6.3 D6.4 D6.5 D8.2 D8.3 D8.4 D8.5 D9_T15P.2 D9_T15P.3 D9_T15P.4 D9_T15P.5 D11.2 D11.3 D11.4 D11.5 D12.2 D12.3 D12.4 D12.5 D14.2 D14.3 D14.4 D14.5 D15.2 D15.3 D15.4 D15.5 D16.2 D16.3 D16.4 D16.5 E6.2 E6.3 E6.4 E6.5 E7.2 E7.3 E7.4 E7.5 E8_T10N.2 E8_T10N.3 E8_T10N.4 E8_T10N.5 E9.2 E9.3 E9.4 E9.5 E10.2 E10.3 E10.4 E10.5 E11.2 E11.3 E11.4 E11.5 E15CLK_2P.2 E15CLK_2P.3 E15CLK_2P.4 E15CLK_2P.5 E16CLK_2N.2 E16CLK_2N.3 E16CLK_2N.4 E16CLK_2N.5 F8_T10P.2 F8_T10P.3 F8_T10P.4 F8_T10P.5 F9.2 F9.3 F9.4 F9.5 F14.2 F14.3 F14.4 F14.5 F15.2 F15.3 F15.4 F15.5 F16.2 F16.3 F16.4 F16.5 G15_R5P.2 G15_R5P.3 G15_R5P.4 G15_R5P.5 G16_R5N.2 G16_R5N.3 G16_R5N.4 G16_R5N.5 IC1.3(GND) IC2.3(GND) IC3.3(GND) IC4.3(GND) J1.26 J4.1 J5.1 J6.1 J7.3 J8.1 J9.1 J10.1 J11.1 J12.3 J13.2 J13.3 J13.4 J13.5 J14.2 J14.3 J14.4 J14.5 J15.1 J16.1 J17.1 J18.1 J19.1-A9 J19.1-C9 J19.2-A9 J19.2-C9 J20.3 J21.3 J22.1 J23.1 J24.1 J25.1 J26.3 J27.3 J28.1 J29.1 J30.1 J31.1 J32.1 J33.1 J34.1 J35.1 J36.1 J37.1 J38.1 J39.1 J40.1 J41.1 J42.1 J43.1 J48.1 J49.1 J50.1 J51.1 J52.1 J53.1 J54.1 J55.1 J141.1 K15_R10P.2 K15_R10P.3 K15_R10P.4 K15_R10P.5 K16_R10N.2 K16_R10N.3 K16_R10N.4 K16_R10N.5 L15_R11P.2 L15_R11P.3 L15_R11P.4 L15_R11P.5 L16_R11N.2 L16_R11N.3 L16_R11N.4 L16_R11N.5 M16CLK_3N.2 M16CLK_3N.3 M16CLK_3N.4 M16CLK_3N.5 N11.2 N11.3 N11.4 N11.5 N12.2 N12.3 N12.4 N12.5 N14.2 N14.3 N14.4 N14.5 N15_R13P.2 N15_R13P.3 N15_R13P.4 N15_R13P.5 N16_R13N.2 N16_R13N.3 N16_R13N.4 N16_R13N.5 OJ1.2 OJ2.2 OJ3.2 OJ4.2 OJ5.2 OJ6.2 OJ7.2 OJ8.2 OJ17.2 OJ18.2 OJ19.2 OJ20.2 OJ21.2 OJ22.2 OJ23.2 OJ24.2 OJ25.2 OJ26.2 OJ27.2 OJ28.2 OJ29.2 OJ30.2 OJ31.2 OJ32.2 OJ33.2 OJ34.2 OJ35.2 OJ36.2 OJ37.2 OJ38.2 OJ39.2 OJ40.2 OJ41.2 OJ42.2 OJ43.2 OJ44.2 OJ45.2 OJ46.2 OJ47.2 OJ48.2 OJ49.2 OJ50.2 OJ51.2 OJ52.2 OJ53.2 OJ54.2 OJ55.2 OJ56.2 OJ57.2 OJ58.2 OJ59.2 OJ60.2 OJ61.2 OJ62.2 OJ63.2 OJ64.2 OJ65.2 OJ66.2 OJ67.2 OJ68.2 OJ69.2 OJ70.2 OJ71.2 OJ72.2 OJ73.2 OJ74.2 OJ75.2 OJ76.2 OJ77.2 OJ78.2 OJ79.2 OJ80.2 OJ89.2 OJ90.2 OJ91.2 OJ92.2 OJ93.2 OJ94.2 OJ95.2 OJ96.2 P9.2 P9.3 P9.4 P9.5 P11.2 P11.3 P11.4 P11.5 P14_CLKOUT_4P.2 P14_CLKOUT_4P.3 P14_CLKOUT_4P.4 P14_CLKOUT_4P.5 P15.2 P15.3 P15.4 P15.5 P16_R15N.2 P16_R15N.3 P16_R15N.4 P16_R15N.5 R1.1(A) R2.1(A) R3.1(A) R4.P$1 R5.P$1 R6.P$1 R7.1(A) R8.2 R9.P$1 R9CLK_7P.2 R9CLK_7P.3 R9CLK_7P.4 R9CLK_7P.5 R10_B16P.2 R10_B16P.3 R10_B16P.4 R10_B16P.5 R11.P$1 R12_B18P.2 R12_B18P.3 R12_B18P.4 R12_B18P.5 R13_B20P.2 R13_B20P.3 R13_B20P.4 R13_B20P.5 R14_CLKOUT_4N.2 R14_CLKOUT_4N.3 R14_CLKOUT_4N.4 R14_CLKOUT_4N.5 R15.P$1 R16_R15P.2 R16_R15P.3 R16_R15P.4 R16_R15P.5 R18.P$1 R19.P$1 R20.P$1 R21.P$1 R22.P$1 R23.P$1 R24.P$1 R25.P$1 R26.P$1 R27.P$1 R28.P$1 R29.P$1 R30.P$1 R31.P$1 R32.P$1 R33.P$1 R35.P$1 R39.P$1 R40.P$1 R41.P$1 R43.P$1 R45.P$1 R46.P$1 R47.P$1 R49.P$1 R50.P$1 R51.P$1 R52.P$1 R53.P$1 R91.P$1 R100.P$1 R111.P$1 R141.P$1 R161.P$1 SV1.12 SV1.30 SV2.12 SV2.30 T9CLK_7N.2 T9CLK_7N.3 T9CLK_7N.4 T9CLK_7N.5 T10_B16N.2 T10_B16N.3 T10_B16N.4 T10_B16N.5 T12_B18N.2 T12_B18N.3 T12_B18N.4 T12_B18N.5 T13_B20N.2 T13_B20N.3 T13_B20N.4 T13_B20N.5 T14_B23P.2 T14_B23P.3 T14_B23P.4 T14_B23P.5 T15_B23N.2 T15_B23N.3 T15_B23N.4 T15_B23N.5 VSLUE2.10(GND) VSLUE3.10(GND) VSLUE4.10(GND) VSLUE5.10(GND) VSLUE6.10(GND) VSLUE7.10(GND) VSLUE8.10(GND) VSLUE9.10(GND) VSLUE11.10(GND) VSLUE.10(GND)
GPIO_00_D3: D3_CLKOUT_3P.1 J50.2 R51.P$2 SV1.2
GPIO_0_IN0_A8CLK: A8CLK_4N.1 J24.2 R23.P$2 SV1.1
GPIO_0_IN1_B8CLK: B8CLK_4P.1 J23.2 R22.P$2 SV1.3
GPIO_01_C3: C3_CLKOUT_3N.1 J30.2 R27.P$2 SV1.4
GPIO_1_IN0_T9CLK: J6.2 R6.P$2 SV2.1 T9CLK_7N.1
GPIO_1_IN1_R9CLK: J5.2 R5.P$2 R9CLK_7P.1 SV2.3
GPIO_02_A2: A2_T2N.1 J22.2 R20.P$2 SV1.5
GPIO_2_IN0_E15CLK: E15CLK_2P.1 J1.2 J16.2 R19.P$2
GPIO_2_IN1_E16CLK: E16CLK_2N.1 J1.3 J15.2 R18.P$2
GPIO_2_IN2_M16CLK: J1.4 J141.2 M16CLK_3N.1 R15.P$2
GPIO_03_A3: A3_T2P.1 J25.2 R25.P$2 SV1.6
GPIO_04_B3: OJ96.1 SV1.7 VSLUE11.6(1A3) VSLUE11.8(1A4)
GPIO_05_B4: OJ94.1 SV1.8 VSLUE11.11(2A1) VSLUE11.13(2A2)
GPIO_06_A4: OJ93.1 SV1.9 VSLUE11.15(2A3) VSLUE11.17(2A4)
GPIO_07_B5: OJ71.1 SV1.10 VSLUE8.2(1A1) VSLUE8.4(1A2)
GPIO_08_A5: OJ72.1 SV1.13 VSLUE8.6(1A3) VSLUE8.8(1A4)
GPIO_09_D5: OJ69.1 SV1.14 VSLUE8.15(2A3) VSLUE8.17(2A4)
GPIO_010_B6: OJ47.1 SV1.15 VSLUE5.2(1A1) VSLUE5.4(1A2)
GPIO_10_F13: J3.2 SV2.2
GPIO_011_A6: OJ48.1 SV1.16 VSLUE5.6(1A3) VSLUE5.8(1A4)
GPIO_11_T15: J40.2 OJ11.2 R39.P$2 SV2.4 T15_B23N.1
GPIO_012_B7: B7_T9P.1 J49.2 R50.P$2 SV1.17
GPIO_12_T14: J4.2 R4.P$2 SV2.5 T14_B23P.1
GPIO_013_D6: OJ55.1 SV1.18 VSLUE6.2(1A1) VSLUE6.4(1A2)
GPIO_13_T13: J38.2 R32.P$2 SV2.6 T13_B20N.1
GPIO_014_A7: A7_T9N.1 J35.2 OJ9.2 R33.P$2 SV1.19
GPIO_14_R13: J17.2 R13_B20P.1 R161.P$2 SV2.7
GPIO_015_C6: OJ56.1 SV1.20 VSLUE6.6(1A3) VSLUE6.8(1A4)
GPIO_15_T12: J9.2 R100.P$2 SV2.8 T12_B18N.1
GPIO_016_C8: OJ53.1 SV1.21 VSLUE6.15(2A3) VSLUE6.17(2A4)
GPIO_16_R12: J10.2 R12_B18P.1 R111.P$2 SV2.9
GPIO_017_E6: OJ54.1 SV1.22 VSLUE6.11(2A1) VSLUE6.13(2A2)
GPIO_17_T11: J3.3 SV2.10
GPIO_018_E7: OJ64.1 SV1.23 VSLUE7.6(1A3) VSLUE7.8(1A4)
GPIO_18_T10: J51.2 R53.P$2 SV2.13 T10_B16N.1
GPIO_019_D8: OJ21.1 SV1.24 VSLUE2.15(2A3) VSLUE2.17(2A4)
GPIO_19_R11: J3.1 SV2.14
GPIO_20_A14: A14_CLKOUT_2N.1 J1.5 J31.2 R29.P$2
GPIO_020_E8: E8_T10N.1 J41.2 OJ12.2 R40.P$2 SV1.25
GPIO_21_B16: J1.6 OJ22.1 VSLUE2.11(2A1) VSLUE2.13(2A2)
GPIO_021_F8: F8_T10P.1 J18.2 R21.P$2 SV1.26
GPIO_22_C14: J1.7 OJ32.1 VSLUE3.6(1A3) VSLUE3.8(1A4)
GPIO_022_F9: OJ62.1 SV1.27 VSLUE7.11(2A1) VSLUE7.13(2A2)
GPIO_23_C16: J1.8 OJ63.1 VSLUE7.2(1A1) VSLUE7.4(1A2)
GPIO_023_E9: OJ24.1 SV1.28 VSLUE2.6(1A3) VSLUE2.8(1A4)
GPIO_024_C9: C9_T15N.1 J8.2 R91.P$2 SV1.31
GPIO_24_C15: J1.9 OJ31.1 VSLUE3.2(1A1) VSLUE3.4(1A2)
GPIO_025_D9: D9_T15P.1 J11.2 R141.P$2 SV1.32
GPIO_25_D16: J1.10 OJ39.1 VSLUE4.2(1A1) VSLUE4.4(1A2)
GPIO_26_D15: J1.11 OJ29.1 VSLUE3.15(2A3) VSLUE3.17(2A4)
GPIO_026_E11: OJ79.1 SV1.33 VSLUE9.2(1A1) VSLUE9.4(1A2)
GPIO_27_D14: J1.12 OJ40.1 VSLUE4.6(1A3) VSLUE4.8(1A4)
GPIO_027_E10: OJ5.1 SV1.34 VSLUE.15(2A3) VSLUE.17(2A4)
GPIO_028_C11: OJ78.1 SV1.35 VSLUE9.11(2A1) VSLUE9.13(2A2)
GPIO_28_F15: J1.13 OJ37.1 VSLUE4.15(2A3) VSLUE4.17(2A4)
GPIO_029_B11: OJ6.1 SV1.36 VSLUE.11(2A1) VSLUE.13(2A2)
GPIO_29_F16: J1.14 OJ38.1 VSLUE4.11(2A1) VSLUE4.13(2A2)
GPIO_030_A12: A12_T21N.1 J36.2 OJ10.2 R9.P$2 SV1.37
GPIO_031_D11: OJ8.1 SV1.38 VSLUE.6(1A3) VSLUE.8(1A4)
GPIO_032_D12: OJ95.1 SV1.39 VSLUE11.2(1A1) VSLUE11.4(1A2)
GPIO_033_B12: B12_T21P.1 J37.2 R11.P$2 SV1.40
GPIO_110_P11: OJ80.1 SV2.15 VSLUE9.6(1A3) VSLUE9.8(1A4)
GPIO_111_R10: J48.2 R10_B16P.1 R49.P$2 SV2.16
GPIO_112_N12: OJ23.1 SV2.17 VSLUE2.2(1A1) VSLUE2.4(1A2)
GPIO_113_P9: OJ45.1 SV2.18 VSLUE5.15(2A3) VSLUE5.17(2A4)
GPIO_114_N9: J3.4 LED1.A R17.P$2 SV2.19 VSLUE2.1(!1OE) VSLUE2.19(!2OE) VSLUE3.1(!1OE) VSLUE3.19(!2OE) VSLUE4.1(!1OE) VSLUE4.19(!2OE) VSLUE5.1(!1OE) VSLUE5.19(!2OE) VSLUE6.1(!1OE) VSLUE6.19(!2OE) VSLUE7.1(!1OE) VSLUE7.19(!2OE) VSLUE8.1(!1OE) VSLUE8.19(!2OE) VSLUE9.1(!1OE) VSLUE9.19(!2OE) VSLUE11.1(!1OE) VSLUE11.19(!2OE) VSLUE.1(!1OE) VSLUE.19(!2OE)
GPIO_115_N11: OJ46.1 SV2.20 VSLUE5.11(2A1) VSLUE5.13(2A2)
GPIO_116_L16: J32.2 L16_R11N.1 R28.P$2 SV2.21
GPIO_117_K16: J33.2 K16_R10N.1 R30.P$2 SV2.22
GPIO_118_R16: J34.2 R16_R15P.1 R31.P$2 SV2.23
GPIO_119_L15: J43.2 L15_R11P.1 R43.P$2 SV2.24
GPIO_120_P15: OJ61.1 SV2.25 VSLUE7.15(2A3) VSLUE7.17(2A4)
GPIO_121_P16: J42.2 P16_R15N.1 R41.P$2 SV2.26
GPIO_122_R14: J53.2 R14_CLKOUT_4N.1 R46.P$2 SV2.27
GPIO_123_N16: J55.2 N16_R13N.1 R52.P$2 SV2.28
GPIO_124_N15: J54.2 N15_R13P.1 R47.P$2 SV2.31
GPIO_125_P14: J52.2 P14_CLKOUT_4P.1 R45.P$2 SV2.32
GPIO_126_L14: J7.2 SV2.33
GPIO_127_N14: OJ70.1 SV2.34 VSLUE8.11(2A1) VSLUE8.13(2A2)
GPIO_128_M10: J12.2 SV2.35
GPIO_129_L13: J7.1 SV2.36
GPIO_130_J16: J12.1 SV2.37
GPIO_131_K15: J39.2 K15_R10P.1 R35.P$2 SV2.38
GPIO_132_J13: OJ77.1 SV2.39 VSLUE9.15(2A3) VSLUE9.17(2A4)
GPIO_133_J14: OJ7.1 SV2.40 VSLUE.2(1A1) VSLUE.4(1A2)
GPIO_210_F14: J1.15 OJ30.1 VSLUE3.11(2A1) VSLUE3.13(2A2)
GPIO_211_G16: G16_R5N.1 J1.16 J28.2 R24.P$2
GPIO_212_G15: G15_R5P.1 J1.17 J29.2 R26.P$2
N$1: C1.1 IC1.2(CAP+)
N$2: C1.2 IC1.4(CAP-)
N$3: C12.1 IC3.2(CAP+)
N$4: C7.1 IC2.2(CAP+)
N$5: C7.2 IC2.4(CAP-)
N$6: C12.2 IC3.4(CAP-)
N$7: C17.1 IC4.2(CAP+)
N$8: C17.2 IC4.4(CAP-)
N$9: LED1.C R8.1
N$10: R1.3(E) R10.P$1
N$11: R2.3(E) R12.P$1
N$12: R3.3(E) R13.P$1
N$13: R7.3(E) R14.P$1
OUT1: J14.1 OJ1.1 VSLUE.16(1Y2) VSLUE.18(1Y1)
OUT2: D11.1 OJ2.1 VSLUE.12(1Y4) VSLUE.14(1Y3)
OUT3: B11.1 OJ3.1 VSLUE.7(2Y2) VSLUE.9(2Y1)
OUT4: E10.1 OJ4.1 VSLUE.3(2Y4) VSLUE.5(2Y3)
OUT9: N12.1 OJ20.1 VSLUE2.16(1Y2) VSLUE2.18(1Y1)
OUT10: E9.1 OJ19.1 VSLUE2.12(1Y4) VSLUE2.14(1Y3)
OUT11: D8.1 OJ17.1 VSLUE2.3(2Y4) VSLUE2.5(2Y3)
OUT12: B16.1 OJ18.1 VSLUE2.7(2Y2) VSLUE2.9(2Y1)
OUT13: C15.1 OJ28.1 VSLUE3.16(1Y2) VSLUE3.18(1Y1)
OUT14: C14.1 OJ27.1 VSLUE3.12(1Y4) VSLUE3.14(1Y3)
OUT15: D15.1 OJ25.1 VSLUE3.3(2Y4) VSLUE3.5(2Y3)
OUT16: F14.1 OJ26.1 VSLUE3.7(2Y2) VSLUE3.9(2Y1)
OUT17: D16.1 OJ36.1 VSLUE4.16(1Y2) VSLUE4.18(1Y1)
OUT18: D14.1 OJ35.1 VSLUE4.12(1Y4) VSLUE4.14(1Y3)
OUT19: F15.1 OJ33.1 VSLUE4.3(2Y4) VSLUE4.5(2Y3)
OUT20: F16.1 OJ34.1 VSLUE4.7(2Y2) VSLUE4.9(2Y1)
OUT21: B6.1 OJ44.1 VSLUE5.16(1Y2) VSLUE5.18(1Y1)
OUT22: A6.1 OJ43.1 VSLUE5.12(1Y4) VSLUE5.14(1Y3)
OUT23: OJ41.1 P9.1 VSLUE5.3(2Y4) VSLUE5.5(2Y3)
OUT24: N11.1 OJ42.1 VSLUE5.7(2Y2) VSLUE5.9(2Y1)
OUT25: D6.1 OJ52.1 VSLUE6.16(1Y2) VSLUE6.18(1Y1)
OUT26: C6.1 OJ51.1 VSLUE6.12(1Y4) VSLUE6.14(1Y3)
OUT27: C8.1 OJ49.1 VSLUE6.3(2Y4) VSLUE6.5(2Y3)
OUT28: E6.1 OJ50.1 VSLUE6.7(2Y2) VSLUE6.9(2Y1)
OUT29: C16.1 OJ60.1 VSLUE7.16(1Y2) VSLUE7.18(1Y1)
OUT30: E7.1 OJ59.1 VSLUE7.12(1Y4) VSLUE7.14(1Y3)
OUT31: OJ57.1 P15.1 VSLUE7.3(2Y4) VSLUE7.5(2Y3)
OUT32: F9.1 OJ58.1 VSLUE7.7(2Y2) VSLUE7.9(2Y1)
OUT33: B5.1 OJ68.1 VSLUE8.16(1Y2) VSLUE8.18(1Y1)
OUT34: A5.1 OJ67.1 VSLUE8.12(1Y4) VSLUE8.14(1Y3)
OUT35: D5.1 OJ65.1 VSLUE8.3(2Y4) VSLUE8.5(2Y3)
OUT36: N14.1 OJ66.1 VSLUE8.7(2Y2) VSLUE8.9(2Y1)
OUT37: E11.1 OJ76.1 VSLUE9.16(1Y2) VSLUE9.18(1Y1)
OUT38: OJ75.1 P11.1 VSLUE9.12(1Y4) VSLUE9.14(1Y3)
OUT39: J13.1 OJ73.1 VSLUE9.3(2Y4) VSLUE9.5(2Y3)
OUT40: C11.1 OJ74.1 VSLUE9.7(2Y2) VSLUE9.9(2Y1)
OUT45: D12.1 OJ92.1 VSLUE11.16(1Y2) VSLUE11.18(1Y1)
OUT46: B3.1 OJ91.1 VSLUE11.12(1Y4) VSLUE11.14(1Y3)
OUT47: A4.1 OJ89.1 VSLUE11.3(2Y4) VSLUE11.5(2Y3)
OUT48: B4.1 OJ90.1 VSLUE11.7(2Y2) VSLUE11.9(2Y1)
Unconnected: IC1.1(NC) IC1.6(LV) IC1.7(OSC) IC2.1(NC) IC2.6(LV) IC2.7(OSC) IC3.1(NC) IC3.6(LV) IC3.7(OSC) IC4.1(NC) IC4.6(LV) IC4.7(OSC) J2.1 J2.2 J2.3 J2.4 J2.5 J2.6 J2.7 J2.8 J2.9 J2.10 J2.11 J2.12 J2.13 J2.14 J2.15 J2.16 J2.17 J2.18 J2.19 J2.20 J2.21 J2.22 J2.23 J2.24 J2.25 J2.26 J19.1-A1 J19.1-A2 J19.1-A3 J19.1-A4 J19.1-A5 J19.1-A6 J19.1-A7 J19.1-A8 J19.1-A10 J19.1-A11 J19.1-A12 J19.1-A13 J19.1-A14 J19.1-A15 J19.1-A16 J19.1-A17 J19.1-A18 J19.1-A19 J19.1-A20 J19.1-A21 J19.1-A22 J19.1-A23 J19.1-A24 J19.1-A25 J19.1-A26 J19.1-A27 J19.1-A28 J19.1-A29 J19.1-A30 J19.1-A31 J19.1-C1 J19.1-C2 J19.1-C3 J19.1-C4 J19.1-C5 J19.1-C6 J19.1-C7 J19.1-C8 J19.1-C10 J19.1-C11 J19.1-C12 J19.1-C13 J19.1-C14 J19.1-C15 J19.1-C16 J19.1-C17 J19.1-C18 J19.1-C19 J19.1-C20 J19.1-C21 J19.1-C22 J19.1-C23 J19.1-C24 J19.1-C25 J19.1-C26 J19.1-C27 J19.1-C28 J19.1-C29 J19.1-C30 J19.1-C31 J19.2-A1 J19.2-A2 J19.2-A3 J19.2-A4 J19.2-A5 J19.2-A6 J19.2-A7 J19.2-A8 J19.2-A10 J19.2-A11 J19.2-A12 J19.2-A13 J19.2-A14 J19.2-A15 J19.2-A16 J19.2-A17 J19.2-A18 J19.2-A19 J19.2-A20 J19.2-A21 J19.2-A22 J19.2-A23 J19.2-A24 J19.2-A25 J19.2-A26 J19.2-A27 J19.2-A28 J19.2-A29 J19.2-A30 J19.2-A31 J19.2-C1 J19.2-C2 J19.2-C3 J19.2-C4 J19.2-C5 J19.2-C6 J19.2-C7 J19.2-C8 J19.2-C10 J19.2-C11 J19.2-C12 J19.2-C13 J19.2-C14 J19.2-C15 J19.2-C16 J19.2-C17 J19.2-C18 J19.2-C19 J19.2-C20 J19.2-C21 J19.2-C22 J19.2-C23 J19.2-C24 J19.2-C25 J19.2-C26 J19.2-C27 J19.2-C28 J19.2-C29 J19.2-C30 J19.2-C31

## Library data of the parts
A2_T2N A3_T2P A4-A6 A7_T9N A8CLK_4N A12_T21N A14_CLKOUT_2N B3-B6 B7_T9P B8CLK_4P B11 B12_T21P B16 C3_CLKOUT_3N C6 C8 C9_T15N C11 C14-C16 D3_CLKOUT_3P D5 D6 D8 D9_T15P D11 D12 D14-D16 E6 E7 E8_T10N E9-E11 E15CLK_2P E16CLK_2N F8_T10P F9 F14-F16 G15_R5P G16_R5N J13 J14 K15_R10P K16_R10N L15_R11P L16_R11N M16CLK_3N N11 N12 N14 N15_R13P N16_R13N P9 P11 P14_CLKOUT_4P P15 P16_R15N R9CLK_7P R10_B16P R12_B18P R13_B20P R14_CLKOUT_4N R16_R15P T9CLK_7N T10_B16N T12_B18N T13_B20N T14_B23P T15_B23N = con-coax:BU-SMB-V: FEMALE SMB CONNECTOR Radiall distributor RS 112-2993; OC_FARNELL: unknown; OC_NEWARK: unknown
C1-C5 C7 C9 C10 C12 C13 C17-C22 C91 C93-C97 = SparkFun-Capacitors:CAP: Capacitor Standard 0603 ceramic capacitor, and 0.1" leaded capacitor.
IC1-IC4 = maxim:ICL7660CPA: VOLTAGE CONVERTER; MF: INTERSIL; MPN: ICL7660CPA; OC_FARNELL: 1018170; OC_NEWARK: 06F7441
J1 J2 = SparkFun-Connectors:M13X2: 0.1" spaced headers
J3 J7 J12 J131 J311 = Seeed-Connector:DIP-BLACK-FEMALE-HEADER-VERT(4P-2.54): 320030017; MPN: F185-1104A1BSYA1
J4-J6 J8-J11 J15-J18 J22-J25 J28-J43 J48-J55 J141 OJ1-OJ12 OJ17-OJ80 OJ89-OJ96 = Seeed-Connector:DIP-BLACK-MALE-HEADER-VERT(2P-2.54): 320020016; MPN: P125-1102A0BS116A1
J19 = 19inch:6HE-?-VG64AC: Euro Card with 2 x VG-64 AC connector
J20 J21 J26 J27 = Seeed-Connector:DIP-BLACK-MALE-HEADER-VERT(4P-2.54): 320020017; MPN: P125-1104A0BS116A1
LED1 = led:LED: LED OSRAM: - CHIPLED LG R971, LG N971, LY N971, LG Q971, LY Q971, LO R971, LY R971 LH N974, LH R974 LS Q976, LO Q976, LY Q976 LO Q996 - Hyper CHIPLED LW Q18S LB Q993, LB Q99A, LB R99A - SideLED LS A670, LO A670, LY A670, LG A670, LP A670 LB A673, LV A673, LT A673, LW A673 LH A674 LY A675 LS A676, LA A676, LO A676, LY A676, LW A676 LS A679, LY A679, LG A679 - Hyper Micro SIDELED® LS Y876, LA Y876, LO Y876, LY Y876 LT Y87S - SmartLED LW L88C, LW L88S LB L89C, LB L89S, LG L890 LS L89K, LO L89K, LY L89K LS L896, LA L896, LO L896, LY L896 - TOPLED LS T670, LO T670, LY T670, LG T670, LP T670 LSG T670, LSP T670, LSY T670, LOP T670, LYG T670 LG T671, LOG T671, LSG T671 LB T673, LV T673, LT T673, LW T673 LH T674 LS T676, LA T676, LO T676, LY T676, LB T676, LH T676, LSB T676, LW T676 LB T67C, LV T67C, LT T67C, LS T67K, LO T67K, LY T67K, LW E67C LS E67B, LA E67B, LO E67B, LY E67B, LB E67C, LV E67C, LT E67C LW T67C LS T679, LY T679, LG T679 LS T770, LO T770, LY T770, LG T770, LP T770 LB T773, LV T773, LT T773, LW T773 LH T774 LS E675, LA E675, LY E675, LS T675 LS T776, LA T776, LO T776, LY T776, LB T776 LHGB T686 LT T68C, LB T68C - Hyper Mini TOPLED® LB M676 - Mini TOPLED Santana® LG M470 LS M47K, LO M47K, LY M47K Source: http://www.osram.convergy.de LUXEON: - LUMILED® LXK2-PW12-R00, LXK2-PW12-S00, LXK2-PW14-U00, LXK2-PW14-V00 LXK2-PM12-R00, LXK2-PM12-S00, LXK2-PM14-U00 LXK2-PE12-Q00, LXK2-PE12-R00, LXK2-PE12-S00, LXK2-PE14-T00, LXK2-PE14-U00 LXK2-PB12-K00, LXK2-PB12-L00, LXK2-PB12-M00, LXK2-PB14-N00, LXK2-PB14-P00, LXK2-PB14-Q00 LXK2-PR12-L00, LXK2-PR12-M00, LXK2-PR14-Q00, LXK2-PR14-R00 LXK2-PD12-Q00, LXK2-PD12-R00, LXK2-PD12-S00 LXK2-PH12-R00, LXK2-PH12-S00 LXK2-PL12-P00, LXK2-PL12-Q00, LXK2-PL12-R00 Source: www.luxeon.com KINGBRIGHT: KA-3528ASYC Source: www.kingbright.com
R1-R3 R7 = resistor:R-TRIMM: Trimm resistor
R4-R6 R9-R15 R17-R33 R35 R39-R41 R43 R45-R47 R49-R53 R91 R100 R111 R141 R161 = SparkFun-Passives:RESISTOR: Resistor Basic schematic elements and footprints for 0603, 1206, and PTH resistors.
R8 = resistor:R-US_: RESISTOR, American symbol
SV1 SV2 = con-lsta:FE20-2: FEMALE HEADER; OC_FARNELL: unknown; OC_NEWARK: unknown
VSLUE VSLUE2-VSLUE9 VSLUE11 = SN74ACT244DW:SN74ACT244DW: SN74ACT244DW, 8-Bit Buffer, Line Driver, ACT, 3-State Non-Inverting 4.5 5.5 V 20-Pin SOIC Source: Datasheet <http://www.ti.com/lit/ds/symlink/sn74act244.pdf>; ARROW_PART_NUMBER: SN74ACT244DW; ARROW_PRICE-STOCK: https://www.arrow.com/en/products/sn74act244dw/texas-instruments; DESCRIPTION: SN74ACT244DW, 8-Bit Buffer, Line Driver, ACT, 3-State Non-Inverting 4.5 5.5 V 20-Pin SOIC; HEIGHT: 2.65mm; MANUFACTURER_NAME: Texas Instruments; MANUFACTURER_PART_NUMBER: SN74ACT244DW; RS_PART_NUMBER: 4363169; RS_PRICE-STOCK: http://uk.rs-online.com/web/p/products/4363169

## Net classes
0 default: width 0.254 mm
1 power: width 0.762 mm